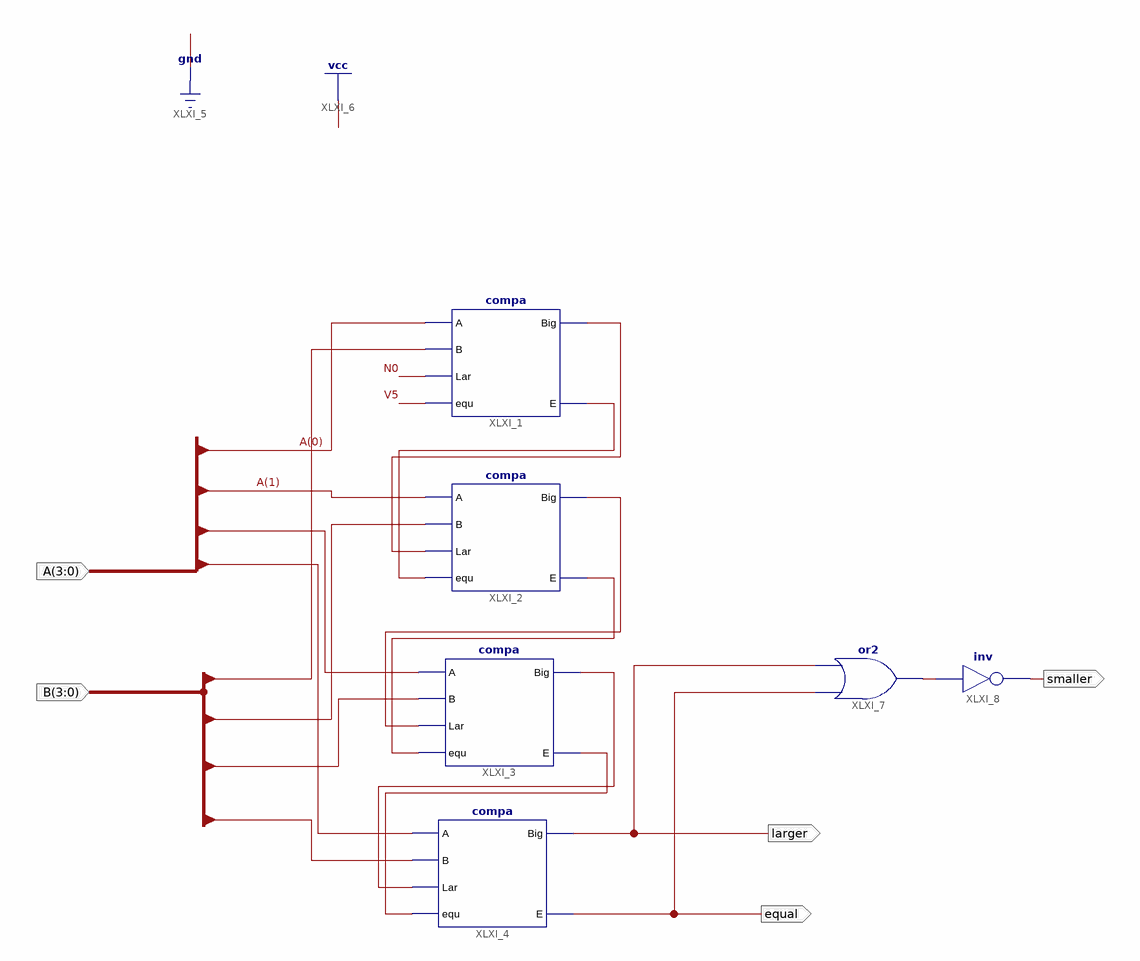
[diagram p0: schematic sheet 1]
// Xilinx ISE schematic comp_ori.sch (kintex7) as structural Verilog: 6 symbols, 5 ports
module comp_ori (
  input  [3:0] A,
  input  [3:0] B,
  output larger,
  output equal,
  output smaller
);

  wire XLXN_19, XLXN_20, XLXN_21, XLXN_22, XLXN_23, XLXN_24, XLXN_27;

  compa XLXI_1 (.A(A[0]), .B(B[0]), .Lar(1'b0), .equ(1'b1), .Big(XLXN_19), .E(XLXN_20));
  compa XLXI_2 (.A(A[1]), .B(B[1]), .Lar(XLXN_19), .equ(XLXN_20), .Big(XLXN_21), .E(XLXN_22));
  compa XLXI_3 (.A(A[2]), .B(B[2]), .Lar(XLXN_21), .equ(XLXN_22), .Big(XLXN_23), .E(XLXN_24));
  compa XLXI_4 (.A(A[3]), .B(B[3]), .Lar(XLXN_23), .equ(XLXN_24), .Big(larger), .E(equal));
  or XLXI_7 (XLXN_27, equal, larger);
  not XLXI_8 (smaller, XLXN_27);
endmodule
